# EAGLE schematic mcuPower (EAGLE 6.4)
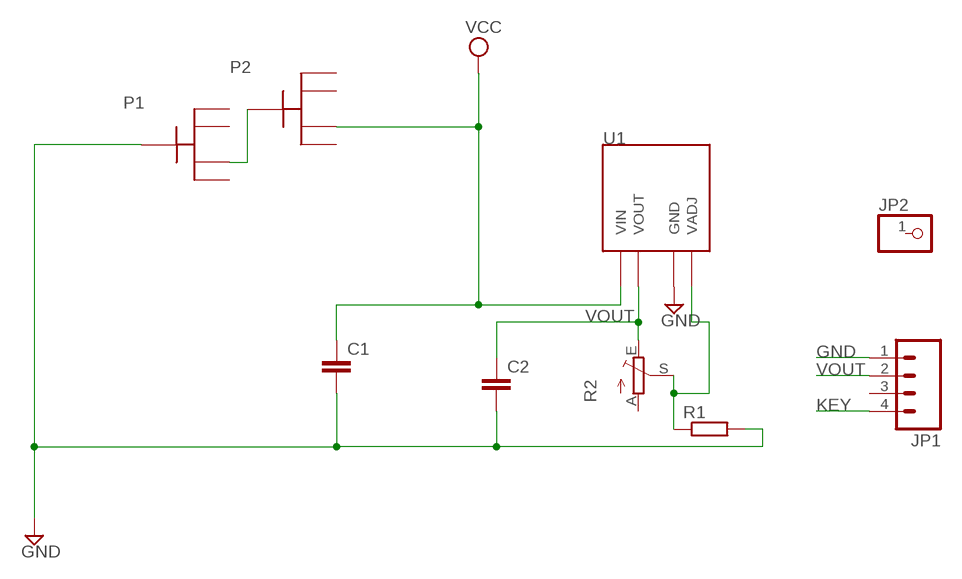
[diagram p0: schematic, sheet 1]

## Parts
C1  C-EUC0805  [C0805]
C2  C-EUC0805  [C0805]
JP1  M04PTH  [1X04]
JP2  PINHD-1X1  [1X01]
P1  CR2032  [CR2032/2025]
P2  CR2032  [CR2032/2025]
R1  R-EU_R0805  [R0805]
R2  TRIM_EU-B25P  [B25P]
U1  PQ070XF01SZH  [TO220-4]

## Nets
GND: C1.2 C2.2 JP1.1 P1.GND R1.2 U1.GND
KEY: JP1.4
N$1: P1.VCC_3 P2.GND
N$2: R1.1 R2.S U1.VADJ
VCC: C1.1 P2.VCC_3 U1.VIN
VOUT: C2.1 JP1.2 R2.E U1.VOUT
Unconnected: JP1.3 JP2.1 P1.VCC_1 P1.VCC_2 P1.VCC_4 P2.VCC_1 P2.VCC_2 P2.VCC_4 R2.A

## Library data of the parts
C1 C2 = resistor:C-EU: CAPACITOR, European symbol
JP1 = SparkFun-Connectors:M04: Header 4 Standard 4-pin 0.1" header. Use with straight break away headers (SKU : PRT-00116), right angle break away headers (PRT-00553), swiss pins (PRT-00743), machine pins (PRT-00117), and female headers (PRT-00115). Molex polarized connector foot print use with SKU : PRT-08231 with associated crimp pins and housings. 1MM SMD Version SKU: PRT-10208
JP2 = adafruit:PINHD-1X1: Pin header 1x1 for 0.1" spacing With round pins
P1 P2 = freddyLibr:CR2032: CR2032/2025 20mm 3V lithium coin cell Great for battery packup. Both SMT and THM holders. Note the THM package has the ground pads on both sides of the PCB so that the masks are the same - this reduces the cost
R1 = resistor:R-EU_: RESISTOR, European symbol
R2 = pot:TRIM_EU-: POTENTIOMETER
U1 = freddyLibr:PQ070XF01SZH: PQ070XF01SZH voltage regulator (TO220-4 package)